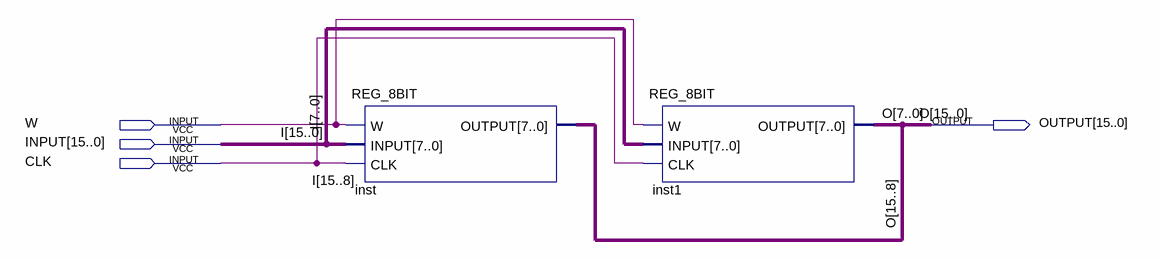
[diagram p0: schematic sheet]
// Quartus schematic REG_16BIT.bdf as structural Verilog: 2 symbols, 4 pins
module REG_16BIT (
  input  W,
  input  [15:0] INPUT,
  input  CLK,
  output [15:0] OUTPUT
);

  REG_8BIT inst (.W(W), .INPUT(INPUT[15:8]), .CLK(CLK), .OUTPUT(OUTPUT[15:8]));
  REG_8BIT inst1 (.W(W), .INPUT(INPUT[7:0]), .CLK(CLK), .OUTPUT(OUTPUT[7:0]));

  // Other names for the same wires on the sheet: I[15:0] = INPUT; O[15:0] = OUTPUT
endmodule
